# EAGLE design cd32 (EAGLE 7.7.0)
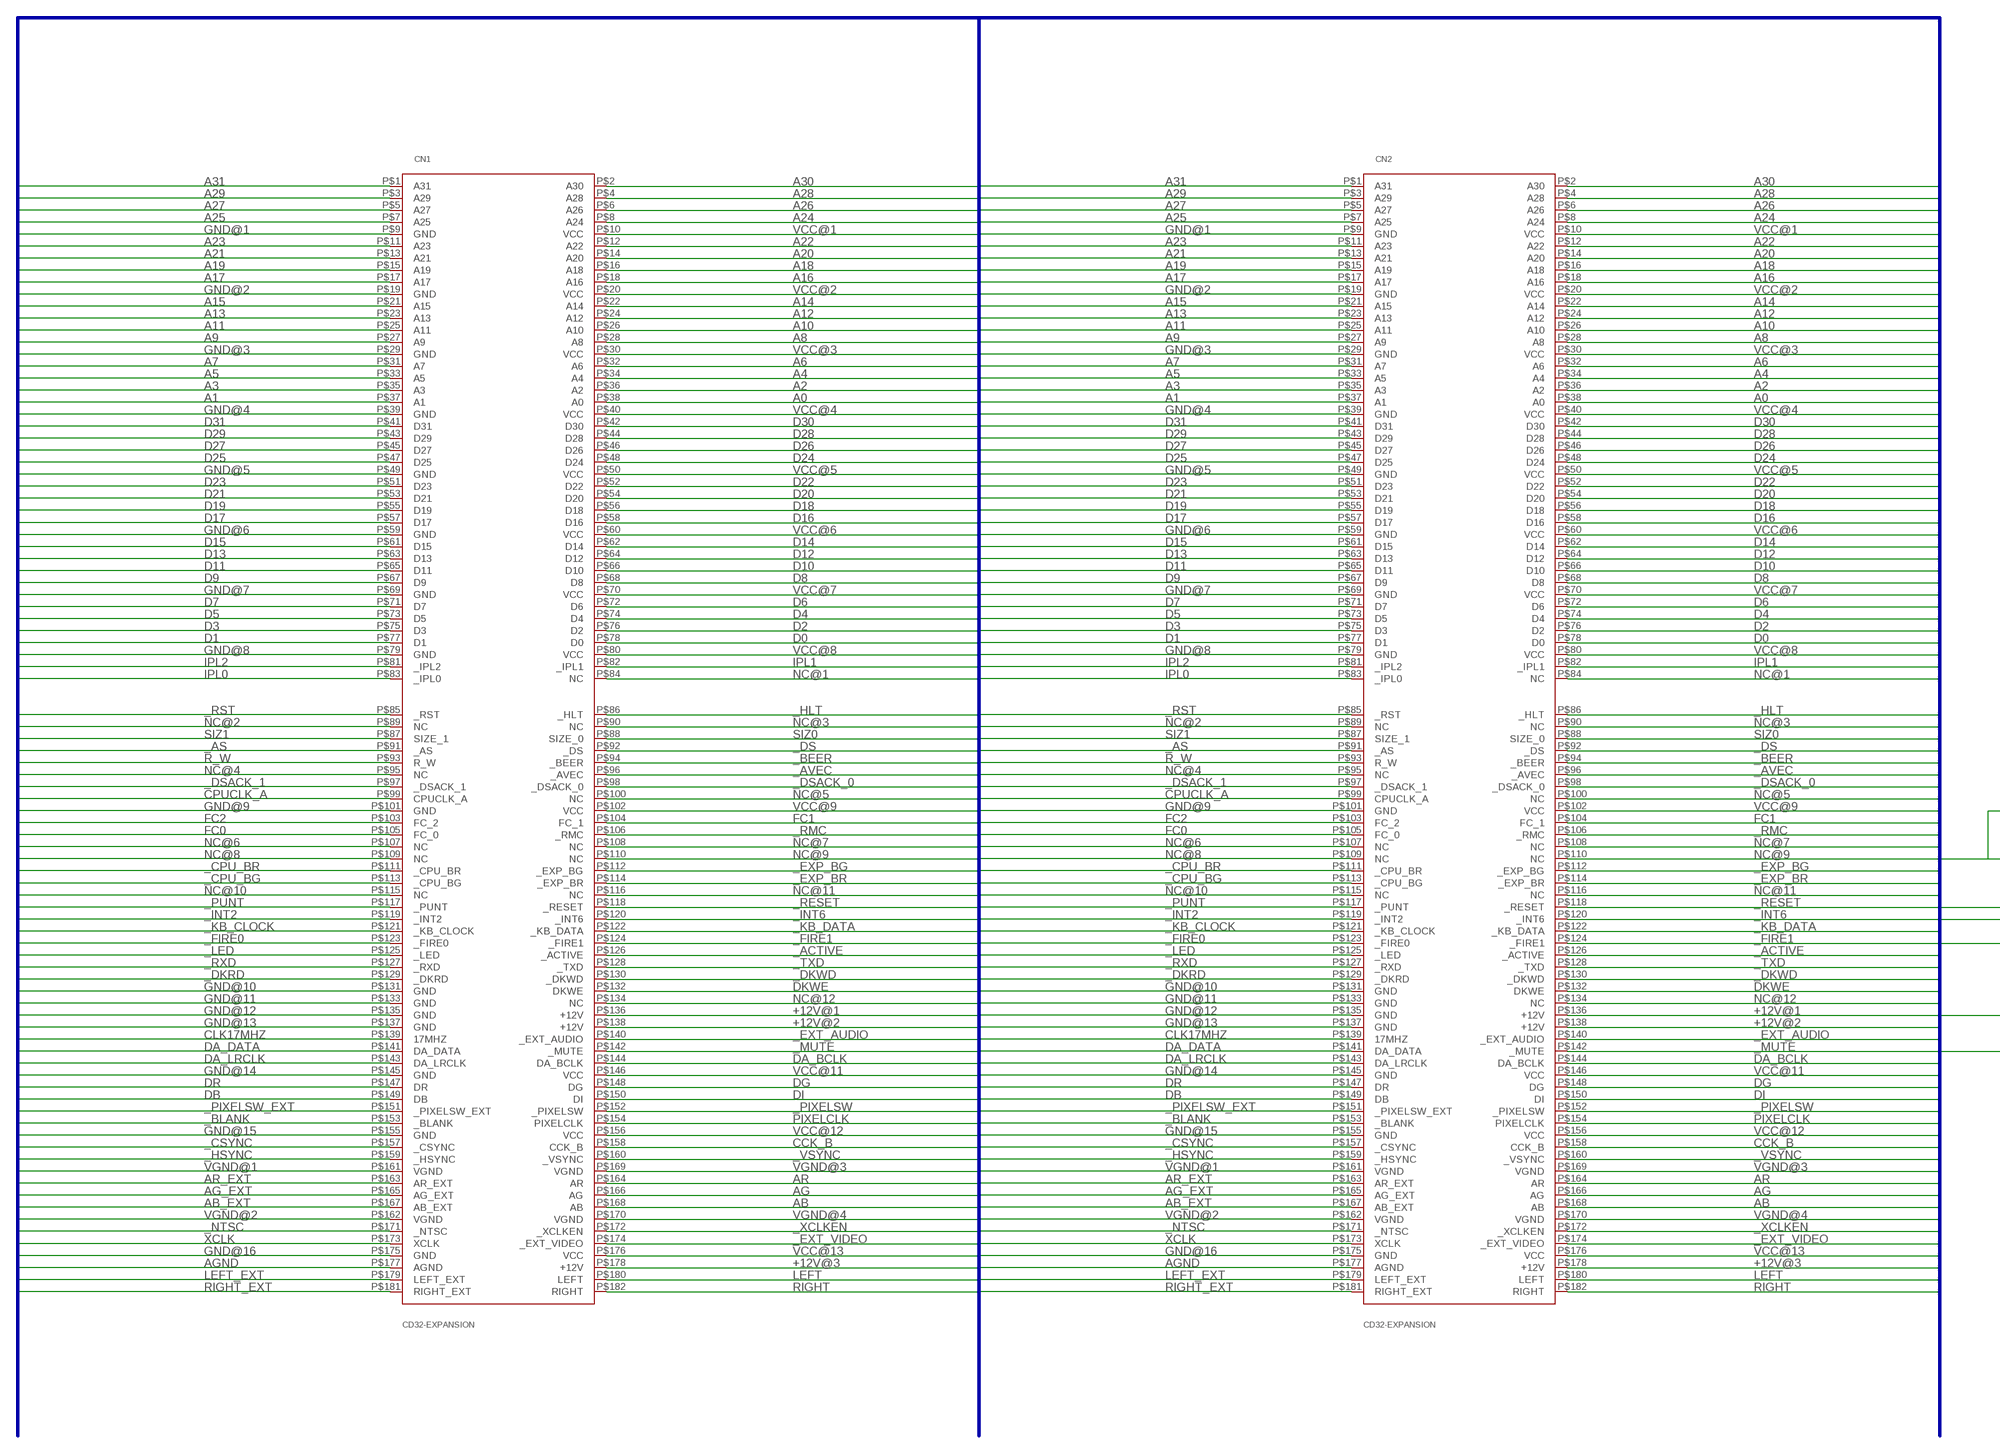
[diagram p0: schematic, sheet 1, part 1 of 2]
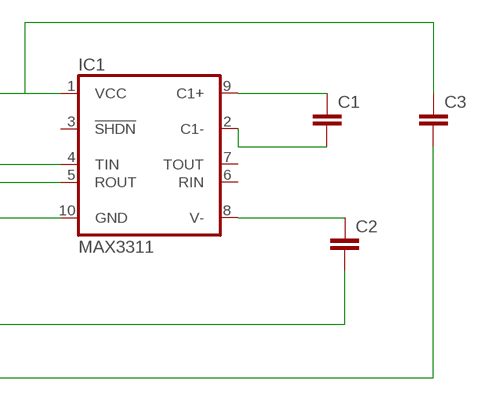
[diagram p1: schematic, sheet 1, part 2 of 2]

## Parts
C1  CC1206  [C1206]
C2  CC1206  [C1206]
C3  CC1206  [C1206]
CN1  CD32-EXPANSION  [CD32_EXPANSION_182_MCA]
CN2  CD32-EXPANSION  [CD32_EXPANSION_182_MCA]
IC1  MAX3311  [UMAX10]

## Nets
+12V@1: C2.2 CN1.P$136(+12V) CN2.P$136(+12V)
+12V@2: CN1.P$138(+12V) CN2.P$138(+12V)
+12V@3: CN1.P$178(+12V) CN2.P$178(+12V)
_ACTIVE: CN1.P$126(_ACTIVE) CN2.P$126(_ACTIVE)
_AS: CN1.P$91(_AS) CN2.P$91(_AS)
_AVEC: CN1.P$96(_AVEC) CN2.P$96(_AVEC)
_BEER: CN1.P$94(_BEER) CN2.P$94(_BEER)
_BLANK: CN1.P$153(_BLANK) CN2.P$153(_BLANK)
_CPU_BG: CN1.P$113(_CPU_BG) CN2.P$113(_CPU_BG)
_CPU_BR: CN1.P$111(_CPU_BR) CN2.P$111(_CPU_BR)
_CSYNC: CN1.P$157(_CSYNC) CN2.P$157(_CSYNC)
_DKRD: CN1.P$129(_DKRD) CN2.P$129(_DKRD)
_DKWD: CN1.P$130(_DKWD) CN2.P$130(_DKWD)
_DS: CN1.P$92(_DS) CN2.P$92(_DS)
_DSACK_0: CN1.P$98(_DSACK_0) CN2.P$98(_DSACK_0)
_DSACK_1: CN1.P$97(_DSACK_1) CN2.P$97(_DSACK_1)
_EXP_BG: CN1.P$112(_EXP_BG) CN2.P$112(_EXP_BG)
_EXP_BR: CN1.P$114(_EXP_BR) CN2.P$114(_EXP_BR)
_EXT_AUDIO: CN1.P$140(_EXT_AUDIO) CN2.P$140(_EXT_AUDIO)
_EXT_VIDEO: CN1.P$174(_EXT_VIDEO) CN2.P$174(_EXT_VIDEO)
_FIRE0: CN1.P$123(_FIRE0) CN2.P$123(_FIRE0)
_FIRE1: CN1.P$124(_FIRE1) CN2.P$124(_FIRE1)
_HLT: CN1.P$86(_HLT) CN2.P$86(_HLT)
_HSYNC: CN1.P$159(_HSYNC) CN2.P$159(_HSYNC)
_INT2: CN1.P$119(_INT2) CN2.P$119(_INT2)
_INT6: CN1.P$120(_INT6) CN2.P$120(_INT6)
_KB_CLOCK: CN1.P$121(_KB_CLOCK) CN2.P$121(_KB_CLOCK)
_KB_DATA: CN1.P$122(_KB_DATA) CN2.P$122(_KB_DATA)
_LED: CN1.P$125(_LED) CN2.P$125(_LED)
_MUTE: CN1.P$142(_MUTE) CN2.P$142(_MUTE)
_NTSC: CN1.P$171(_NTSC) CN2.P$171(_NTSC)
_PIXELSW: CN1.P$152(_PIXELSW) CN2.P$152(_PIXELSW)
_PIXELSW_EXT: CN1.P$151(_PIXELSW_EXT) CN2.P$151(_PIXELSW_EXT)
_PUNT: CN1.P$117(_PUNT) CN2.P$117(_PUNT)
_RESET: CN1.P$118(_RESET) CN2.P$118(_RESET)
_RMC: CN1.P$106(_RMC) CN2.P$106(_RMC)
_RST: CN1.P$85(_RST) CN2.P$85(_RST)
_RXD: CN1.P$127(_RXD) CN2.P$127(_RXD) IC1.5(ROUT)
_TXD: CN1.P$128(_TXD) CN2.P$128(_TXD) IC1.4(TIN)
_VSYNC: CN1.P$160(_VSYNC) CN2.P$160(_VSYNC)
_XCLKEN: CN1.P$172(_XCLKEN) CN2.P$172(_XCLKEN)
A0: CN1.P$38(A0) CN2.P$38(A0)
A1: CN1.P$37(A1) CN2.P$37(A1)
A2: CN1.P$36(A2) CN2.P$36(A2)
A3: CN1.P$35(A3) CN2.P$35(A3)
A4: CN1.P$34(A4) CN2.P$34(A4)
A5: CN1.P$33(A5) CN2.P$33(A5)
A6: CN1.P$32(A6) CN2.P$32(A6)
A7: CN1.P$31(A7) CN2.P$31(A7)
A8: CN1.P$28(A8) CN2.P$28(A8)
A9: CN1.P$27(A9) CN2.P$27(A9)
A10: CN1.P$26(A10) CN2.P$26(A10)
A11: CN1.P$25(A11) CN2.P$25(A11)
A12: CN1.P$24(A12) CN2.P$24(A12)
A13: CN1.P$23(A13) CN2.P$23(A13)
A14: CN1.P$22(A14) CN2.P$22(A14)
A15: CN1.P$21(A15) CN2.P$21(A15)
A16: CN1.P$18(A16) CN2.P$18(A16)
A17: CN1.P$17(A17) CN2.P$17(A17)
A18: CN1.P$16(A18) CN2.P$16(A18)
A19: CN1.P$15(A19) CN2.P$15(A19)
A20: CN1.P$14(A20) CN2.P$14(A20)
A21: CN1.P$13(A21) CN2.P$13(A21)
A22: CN1.P$12(A22) CN2.P$12(A22)
A23: CN1.P$11(A23) CN2.P$11(A23)
A24: CN1.P$8(A24) CN2.P$8(A24)
A25: CN1.P$7(A25) CN2.P$7(A25)
A26: CN1.P$6(A26) CN2.P$6(A26)
A27: CN1.P$5(A27) CN2.P$5(A27)
A28: CN1.P$4(A28) CN2.P$4(A28)
A29: CN1.P$3(A29) CN2.P$3(A29)
A30: CN1.P$2(A30) CN2.P$2(A30)
A31: CN1.P$1(A31) CN2.P$1(A31)
AB: CN1.P$168(AB) CN2.P$168(AB)
AB_EXT: CN1.P$167(AB_EXT) CN2.P$167(AB_EXT)
AG: CN1.P$166(AG) CN2.P$166(AG)
AG_EXT: CN1.P$165(AG_EXT) CN2.P$165(AG_EXT)
AGND: CN1.P$177(AGND) CN2.P$177(AGND)
AR: CN1.P$164(AR) CN2.P$164(AR)
AR_EXT: CN1.P$163(AR_EXT) CN2.P$163(AR_EXT)
CCK_B: CN1.P$158(CCK_B) CN2.P$158(CCK_B)
CLK17MHZ: CN1.P$139(17MHZ) CN2.P$139(17MHZ)
CPUCLK_A: CN1.P$99(CPUCLK_A) CN2.P$99(CPUCLK_A)
D0: CN1.P$78(D0) CN2.P$78(D0)
D1: CN1.P$77(D1) CN2.P$77(D1)
D2: CN1.P$76(D2) CN2.P$76(D2)
D3: CN1.P$75(D3) CN2.P$75(D3)
D4: CN1.P$74(D4) CN2.P$74(D4)
D5: CN1.P$73(D5) CN2.P$73(D5)
D6: CN1.P$72(D6) CN2.P$72(D6)
D7: CN1.P$71(D7) CN2.P$71(D7)
D8: CN1.P$68(D8) CN2.P$68(D8)
D9: CN1.P$67(D9) CN2.P$67(D9)
D10: CN1.P$66(D10) CN2.P$66(D10)
D11: CN1.P$65(D11) CN2.P$65(D11)
D12: CN1.P$64(D12) CN2.P$64(D12)
D13: CN1.P$63(D13) CN2.P$63(D13)
D14: CN1.P$62(D14) CN2.P$62(D14)
D15: CN1.P$61(D15) CN2.P$61(D15)
D16: CN1.P$58(D16) CN2.P$58(D16)
D17: CN1.P$57(D17) CN2.P$57(D17)
D18: CN1.P$56(D18) CN2.P$56(D18)
D19: CN1.P$55(D19) CN2.P$55(D19)
D20: CN1.P$54(D20) CN2.P$54(D20)
D21: CN1.P$53(D21) CN2.P$53(D21)
D22: CN1.P$52(D22) CN2.P$52(D22)
D23: CN1.P$51(D23) CN2.P$51(D23)
D24: CN1.P$48(D24) CN2.P$48(D24)
D25: CN1.P$47(D25) CN2.P$47(D25)
D26: CN1.P$46(D26) CN2.P$46(D26)
D27: CN1.P$45(D27) CN2.P$45(D27)
D28: CN1.P$44(D28) CN2.P$44(D28)
D29: CN1.P$43(D29) CN2.P$43(D29)
D30: CN1.P$42(D30) CN2.P$42(D30)
D31: CN1.P$41(D31) CN2.P$41(D31)
DA_BCLK: CN1.P$144(DA_BCLK) CN2.P$144(DA_BCLK)
DA_DATA: CN1.P$141(DA_DATA) CN2.P$141(DA_DATA)
DA_LRCLK: CN1.P$143(DA_LRCLK) CN2.P$143(DA_LRCLK)
DB: CN1.P$149(DB) CN2.P$149(DB)
DG: CN1.P$148(DG) CN2.P$148(DG)
DI: CN1.P$150(DI) CN2.P$150(DI)
DKWE: CN1.P$132(DKWE) CN2.P$132(DKWE)
DR: CN1.P$147(DR) CN2.P$147(DR)
FC0: CN1.P$105(FC_0) CN2.P$105(FC_0)
FC1: CN1.P$104(FC_1) CN2.P$104(FC_1)
FC2: CN1.P$103(FC_2) CN2.P$103(FC_2)
GND: C3.2 IC1.10(GND)
GND@1: CN1.P$9(GND) CN2.P$9(GND)
GND@2: CN1.P$19(GND) CN2.P$19(GND)
GND@3: CN1.P$29(GND) CN2.P$29(GND)
GND@4: CN1.P$39(GND) CN2.P$39(GND)
GND@5: CN1.P$49(GND) CN2.P$49(GND)
GND@6: CN1.P$59(GND) CN2.P$59(GND)
GND@7: CN1.P$69(GND) CN2.P$69(GND)
GND@8: CN1.P$79(GND) CN2.P$79(GND)
GND@9: CN1.P$101(GND) CN2.P$101(GND)
GND@10: CN1.P$131(GND) CN2.P$131(GND)
GND@11: CN1.P$133(GND) CN2.P$133(GND)
GND@12: CN1.P$135(GND) CN2.P$135(GND)
GND@13: CN1.P$137(GND) CN2.P$137(GND)
GND@14: CN1.P$145(GND) CN2.P$145(GND)
GND@15: CN1.P$155(GND) CN2.P$155(GND)
GND@16: CN1.P$175(GND) CN2.P$175(GND)
IPL0: CN1.P$83(_IPL0) CN2.P$83(_IPL0)
IPL1: CN1.P$82(_IPL1) CN2.P$82(_IPL1)
IPL2: CN1.P$81(_IPL2) CN2.P$81(_IPL2)
LEFT: CN1.P$180(LEFT) CN2.P$180(LEFT)
LEFT_EXT: CN1.P$179(LEFT_EXT) CN2.P$179(LEFT_EXT)
N$1: C1.1 IC1.9(C1+)
N$2: C1.2 IC1.2(C1-)
N$3: C2.1 IC1.8(V-)
NC@1: CN1.P$84(NC) CN2.P$84(NC)
NC@2: CN1.P$89(NC) CN2.P$89(NC)
NC@3: CN1.P$90(NC) CN2.P$90(NC)
NC@4: CN1.P$95(NC) CN2.P$95(NC)
NC@5: CN1.P$100(NC) CN2.P$100(NC)
NC@6: CN1.P$107(NC) CN2.P$107(NC)
NC@7: CN1.P$108(NC) CN2.P$108(NC)
NC@8: CN1.P$109(NC) CN2.P$109(NC)
NC@9: CN1.P$110(NC) CN2.P$110(NC)
NC@10: CN1.P$115(NC) CN2.P$115(NC)
NC@11: CN1.P$116(NC) CN2.P$116(NC)
NC@12: CN1.P$134(NC) CN2.P$134(NC)
PIXELCLK: CN1.P$154(PIXELCLK) CN2.P$154(PIXELCLK)
R_W: CN1.P$93(R_W) CN2.P$93(R_W)
RIGHT: CN1.P$182(RIGHT) CN2.P$182(RIGHT)
RIGHT_EXT: CN1.P$181(RIGHT_EXT) CN2.P$181(RIGHT_EXT)
SIZ0: CN1.P$88(SIZE_0) CN2.P$88(SIZE_0)
SIZ1: CN1.P$87(SIZE_1) CN2.P$87(SIZE_1)
VCC: C3.1 IC1.1(VCC)
VCC@1: CN1.P$10(VCC) CN2.P$10(VCC)
VCC@2: CN1.P$20(VCC) CN2.P$20(VCC)
VCC@3: CN1.P$30(VCC) CN2.P$30(VCC)
VCC@4: CN1.P$40(VCC) CN2.P$40(VCC)
VCC@5: CN1.P$50(VCC) CN2.P$50(VCC)
VCC@6: CN1.P$60(VCC) CN2.P$60(VCC)
VCC@7: CN1.P$70(VCC) CN2.P$70(VCC)
VCC@8: CN1.P$80(VCC) CN2.P$80(VCC)
VCC@9: CN1.P$102(VCC) CN2.P$102(VCC)
VCC@11: CN1.P$146(VCC) CN2.P$146(VCC)
VCC@12: CN1.P$156(VCC) CN2.P$156(VCC)
VCC@13: CN1.P$176(VCC) CN2.P$176(VCC)
VGND@1: CN1.P$161(VGND) CN2.P$161(VGND)
VGND@2: CN1.P$162(VGND) CN2.P$162(VGND)
VGND@3: CN1.P$169(VGND) CN2.P$169(VGND)
VGND@4: CN1.P$170(VGND) CN2.P$170(VGND)
XCLK: CN1.P$173(XCLK) CN2.P$173(XCLK)
Unconnected: IC1.3(!SHDN) IC1.6(RIN) IC1.7(TOUT)

## Buses
A[0..31],AB,AB_EXT,_ACTIVE,AG,AG_EXT,AGND,AR,AR_EXT,_AS,_AVEC,_BEER,_BLANK,CCK_B,CLK_17MHZ,_CPU_BG,_CPU_BR,CPUCLK_A,_CSYNC,D[0..31],DA_BCLK,DA_DATA,DA_LRCLK,DB,DG,DI,_DKRD,_DKWD,DKWE,DR,_DS,_DSACK_0,_DSACK_1,_EXP_BG,_EXP_BR,_EXT_AUDIO,_EXT_VIDEO,FC[0..2],_FIRE0,_FIRE1,GND,_HLT,_HSYNC,_INT2,_INT6,_IPL[0..2],_KB_CLOCK,_KB_DATA,_LED,LEFT,LEFT_EXT,_MUTE,NC,_NTSC,PIXELCLK,_PIXELSW,_PIXELSW_EXT,_PUNT,_RESET,RIGHT,RIGHT_EXT,_RMC,_RST,R_W,_RXD,SIZE[0..1],_TXD,VCC,VCC12V,VGND,_VSYNC,XCLK,_XCLKEN

## Library data of the parts
C1-C3 = eagle-ltspice:C: CAPACITOR, European symbol; SPICEMODEL: NONE; SPICEPREFIX: C
CN1 CN2 = Amiga:CD32-EXPANSION
IC1 = maxim:MAX3311: 460kbps, 1µA Supply Current, RS-232-Compatible Transceivers in µMAX Source: http://www.maxim-ic.com .. MAX3311-MAX3313.pdf; MF: MAXIM; MPN: MAX3311ECUB+; OC_FARNELL: 1379937; OC_NEWARK: 67K4953

## Board
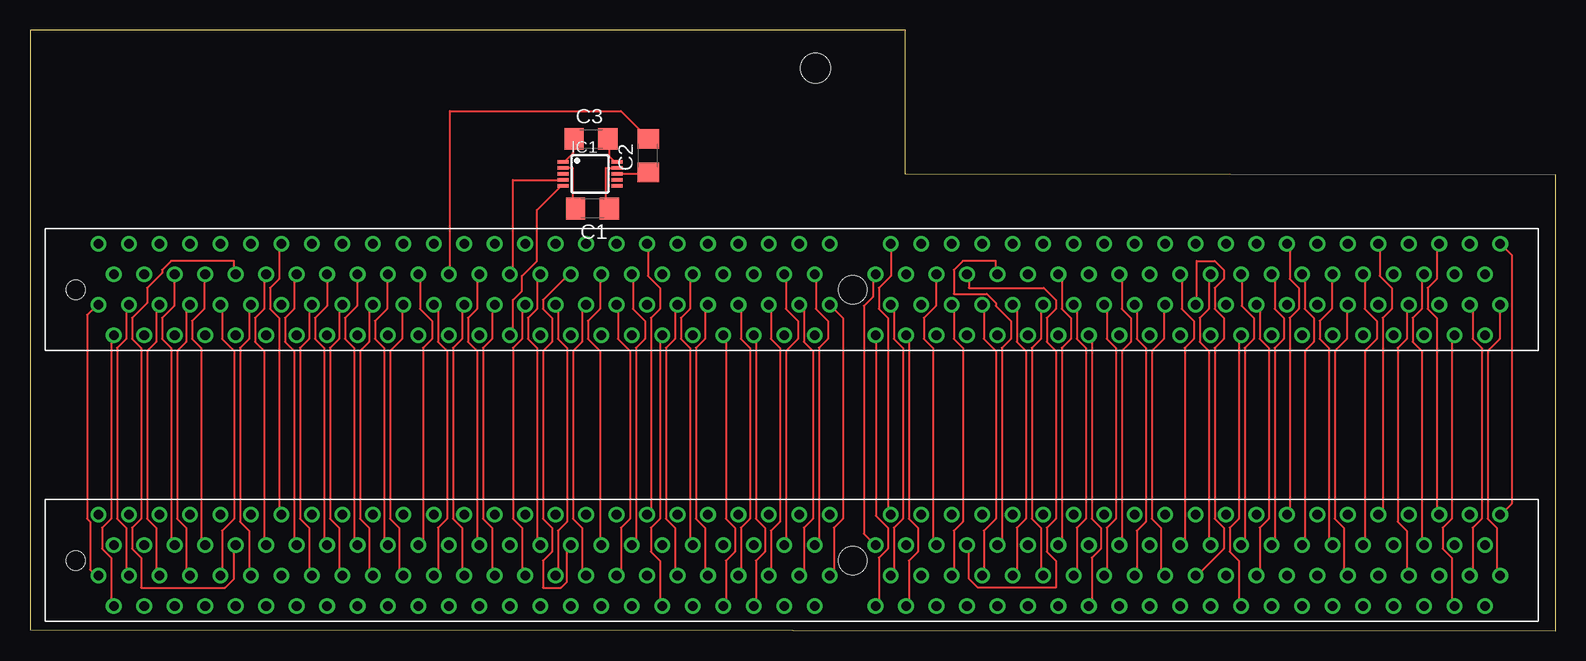
[diagram p2: board, top side]
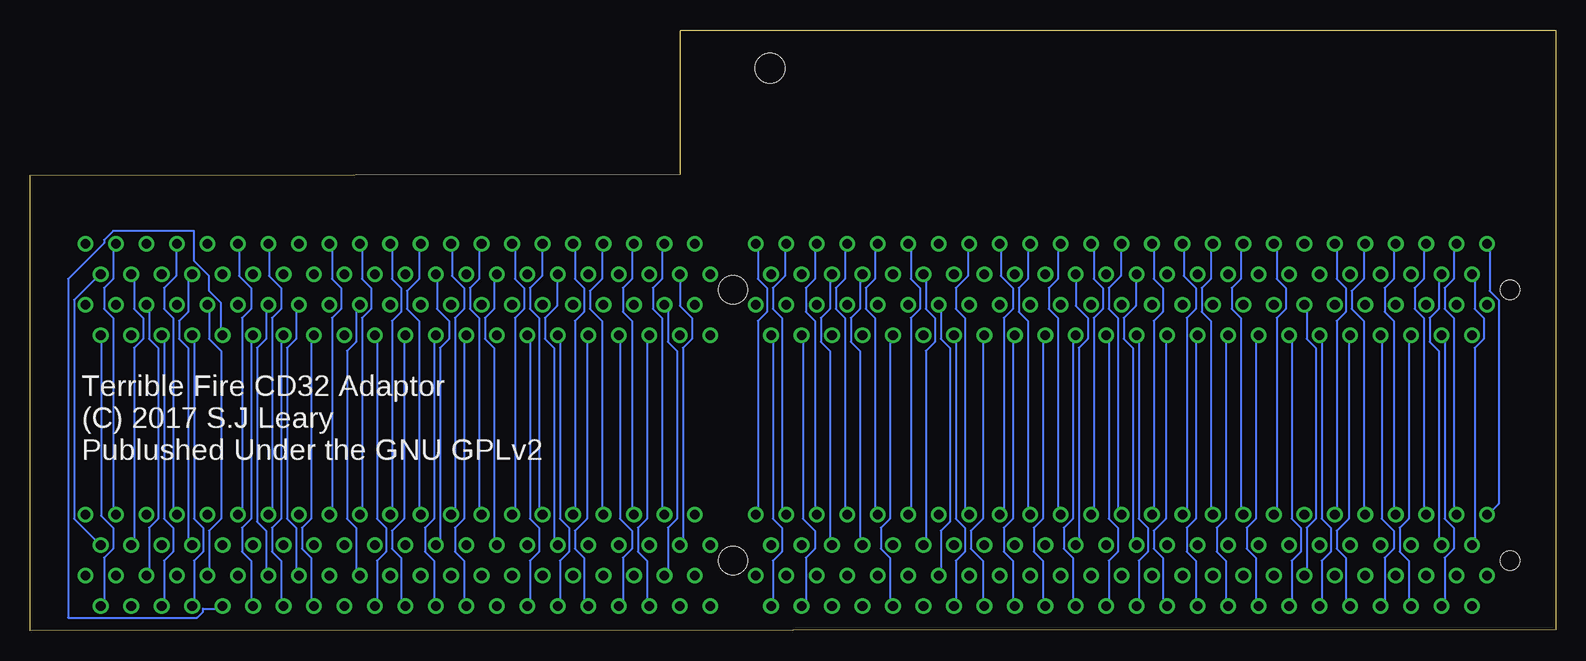
[diagram p3: board, bottom side, seen from below]

Size 127.18 x 50.1 mm. Coordinates in mm from the lower left corner, seen from the top.
Outline: 0,0.1 127.18,0 127.18,38 72.97,38.1 72.97,50.1 0,50.1 0,0.1
Copper layers (1*16): Top 0.035mm / dielectric 1.5mm / Bottom 0.035mm
Design rules "dirt_cheap_dirty_boards.v1 *": minimum track width 7mil, minimum drill 12mil, track to track 6mil, track to pad 6mil, pad to pad 6mil, via to via 6mil, smd to smd 0mil, copper to edge 10mil, drill to drill 10mil, minimum pad ring 10mil, minimum via ring 6mil, stop-mask expansion 2mil, vias tented up to drill 25mil, thermal gap 10mil
Holes 2.5 mm at 65.49,46.92

### Footprints (pad centres in the part's own frame; a part is rotated, then mirrored left to right if it is on the bottom)
C1206 = smd 1.6 x 1.8: 1 -1.4,0; 2 1.4,0
CD32_EXPANSION_182_MCA = drill 0.8: P$1 59.055,-1.27; P$2 59.055,3.81; P$3 57.785,-3.81; P$4 57.785,1.27; P$5 56.515,-1.27; P$6 56.515,3.81; P$7 55.245,-3.81; P$8 55.245,1.27; P$9 53.975,-1.27; P$10 53.975,3.81; P$11 52.705,-3.81; P$12 52.705,1.27; P$13 51.435,-1.27; P$14 51.435,3.81; P$15 50.165,-3.81; P$16 50.165,1.27; P$17 48.895,-1.27; P$18 48.895,3.81; P$19 47.625,-3.81; P$20 47.625,1.27; P$21 46.355,-1.27; P$22 46.355,3.81; P$23 45.085,-3.81; P$24 45.085,1.27; P$25 43.815,-1.27; P$26 43.815,3.81; P$27 42.545,-3.81; P$28 42.545,1.27; P$29 41.275,-1.27; P$30 41.275,3.81; P$31 40.005,-3.81; P$32 40.005,1.27; P$33 38.735,-1.27; P$34 38.735,3.81; P$35 37.465,-3.81; P$36 37.465,1.27; P$37 36.195,-1.27; P$38 36.195,3.81; P$39 34.925,-3.81; P$40 34.925,1.27; P$41 33.655,-1.27; P$42 33.655,3.81; P$43 32.385,-3.81; P$44 32.385,1.27; P$45 31.115,-1.27; P$46 31.115,3.81; P$47 29.845,-3.81; P$48 29.845,1.27; P$49 28.575,-1.27; P$50 28.575,3.81; P$51 27.305,-3.81; P$52 27.305,1.27; P$53 26.035,-1.27; P$54 26.035,3.81; P$55 24.765,-3.81; P$56 24.765,1.27; P$57 23.495,-1.27; P$58 23.495,3.81; P$59 22.225,-3.81; P$60 22.225,1.27; P$61 20.955,-1.27; P$62 20.955,3.81; P$63 19.685,-3.81; P$64 19.685,1.27; P$65 18.415,-1.27; P$66 18.415,3.81; P$67 17.145,-3.81; P$68 17.145,1.27; P$69 15.875,-1.27; P$70 15.875,3.81; P$71 14.605,-3.81; P$72 14.605,1.27; P$73 13.335,-1.27; P$74 13.335,3.81; P$75 12.065,-3.81; P$76 12.065,1.27; P$77 10.795,-1.27; P$78 10.795,3.81; P$79 9.525,-3.81; P$80 9.525,1.27; P$81 8.255,-1.27; P$82 8.255,3.81; P$83 6.985,-3.81; P$84 6.985,1.27; P$85 3.175,-1.27; P$86 3.175,3.81; P$87 1.905,-3.81; P$88 1.905,1.27; P$89 0.635,-1.27; P$90 0.635,3.81; P$91 -0.635,-3.81; P$92 -0.635,1.27; P$93 -1.905,-1.27; P$94 -1.905,3.81; P$95 -3.175,-3.81; P$96 -3.175,1.27; P$97 -4.445,-1.27; P$98 -4.445,3.81; P$99 -5.715,-3.81; P$100 -5.715,1.27; P$101 -6.985,-1.27; P$102 -6.985,3.81; P$103 -8.255,-3.81; P$104 -8.255,1.27; P$105 -9.525,-1.27; P$106 -9.525,3.81; P$107 -10.795,-3.81; P$108 -10.795,1.27; P$109 -12.065,-1.27; P$110 -12.065,3.81; P$111 -13.335,-3.81; P$112 -13.335,1.27; P$113 -14.605,-1.27; P$114 -14.605,3.81; P$115 -15.875,-3.81; P$116 -15.875,1.27; P$117 -17.145,-1.27; P$118 -17.145,3.81; P$119 -18.415,-3.81; P$120 -18.415,1.27; P$121 -19.685,-1.27; P$122 -19.685,3.81; P$123 -20.955,-3.81; P$124 -20.955,1.27; P$125 -22.225,-1.27; P$126 -22.225,3.81; P$127 -23.495,-3.81; P$128 -23.495,1.27; P$129 -24.765,-1.27; P$130 -24.765,3.81; P$131 -26.035,-3.81; P$132 -26.035,1.27; P$133 -27.305,-1.27; P$134 -27.305,3.81; P$135 -28.575,-3.81; P$136 -28.575,1.27; P$137 -29.845,-1.27; P$138 -29.845,3.81; P$139 -31.115,-3.81; P$140 -31.115,1.27; P$141 -32.385,-1.27; P$142 -32.385,3.81; P$143 -33.655,-3.81; P$144 -33.655,1.27; P$145 -34.925,-1.27; P$146 -34.925,3.81; P$147 -36.195,-3.81; P$148 -36.195,1.27; P$149 -37.465,-1.27; P$150 -37.465,3.81; P$151 -38.735,-3.81; P$152 -38.735,1.27; P$153 -40.005,-1.27; P$154 -40.005,3.81; P$155 -41.275,-3.81; P$156 -41.275,1.27; P$157 -42.545,-1.27; P$158 -42.545,3.81; P$159 -43.815,-3.81; P$160 -43.815,1.27; P$161 -45.085,-1.27; P$162 -45.085,3.81; P$163 -46.355,-3.81; P$164 -46.355,1.27; P$165 -47.625,-1.27; P$166 -47.625,3.81; P$167 -48.895,-3.81; P$168 -48.895,1.27; P$169 -50.165,-1.27; P$170 -50.165,3.81; P$171 -51.435,-3.81; P$172 -51.435,1.27; P$173 -52.705,-1.27; P$174 -52.705,3.81; P$175 -53.975,-3.81; P$176 -53.975,1.27; P$177 -55.245,-1.27; P$178 -55.245,3.81; P$179 -56.515,-3.81; P$180 -56.515,1.27; P$181 -57.785,-1.27; P$182 -57.785,3.81 | hole 2.362: 5.08,0 | hole 1.6: -59.69,0
UMAX10 = smd 0.32 x 0.9: 1 -1,-2.25; 2 -0.5,-2.25; 3 0,-2.25; 4 0.5,-2.25; 5 1,-2.25; 6 1,2.25; 7 0.5,2.25; 8 0,2.25; 9 -0.5,2.25; 10 -1,2.25

### Placement (x,y rotation side)
C1  46.89,35.2 180 top
C2  51.54,39.62 90 top
C3  46.76,41.02 0 top
CN1  63.5,5.87 0 top
CN2  63.5,28.45 0 top
IC1  46.69,38.1 270 top

### Tracks (layer width: path | path; a pad name or v marks a point on that pad's centre or on a via)
+12V@1
  Top 0.178: C2.2 51.5,41.1 49.25,43.35 35,43.35 35,29.85 CN2.P$136
  Bottom 0.178: CN1.P$136 35,7.35 35.25,7.6 35.25,23.6 36,24.35 36,26.1 35,27.1 35,29.6 CN2.P$136
+12V@2
  Bottom 0.178: CN1.P$138 33.5,9.85 33.5,25.85 32.75,26.6 32.75,28.6 33.5,29.35 33.5,32.1 CN2.P$138
+12V@3
  Bottom 0.178: CN1.P$178 8.5,9.85 8.5,26.1 9.25,26.85 9.25,28.6 8.5,29.35 8.5,32.1 CN2.P$178
_ACTIVE
  Bottom 0.178: CN1.P$126 41.5,9.85 41.5,26.1 42.25,26.85 42.25,28.6 41.5,29.35 41.5,32.1 CN2.P$126
_AS
  Bottom 0.178: CN1.P$91 62.75,2.1 62.5,2.35 62.5,6.1 61.75,6.85 61.75,8.35 62.75,9.35 62.75,24.6 CN2.P$91
_AVEC
  Bottom 0.178: CN1.P$96 60.5,7.35 60.5,23.35 61.25,24.1 61.25,26.1 60.5,26.85 60.5,29.6 CN2.P$96
_BEER
  Bottom 0.178: CN1.P$94 61.75,9.85 61.75,25.85 62.5,26.6 62.5,28.6 61.75,29.35 61.75,32.1 CN2.P$94
_BLANK
  Top 0.178: CN1.P$153 23.25,4.6 23.25,8.6 22.5,9.35 22.5,23.6 23.25,24.35 23.25,27.1 CN2.P$153
_CPU_BG
  Top 0.178: CN1.P$113 49,4.6 49.25,4.85 49.25,8.6 50,9.35 50,23.35 49,24.35 49,27.1 CN2.P$113
_CPU_BR
  Bottom 0.178: CN1.P$111 50,2.1 50,5.85 49.25,6.6 49.25,8.6 50,9.35 50,24.6 CN2.P$111
_CSYNC
  Bottom 0.178: CN1.P$157 20.75,4.6 20.75,8.6 20,9.35 20,23.6 20.75,24.35 20.75,27.1 CN2.P$157
_DKRD
  Top 0.178: CN1.P$129 38.5,4.6 38.5,8.6 37.75,9.35 37.75,23.6 38.5,24.35 38.5,27.1 CN2.P$129
_DKWD
  Bottom 0.178: CN1.P$130 38.5,9.85 38.5,26.1 37.75,26.85 37.75,28.6 38.5,29.35 38.5,32.1 CN2.P$130
_DS
  Top 0.178: CN1.P$92 63,7.35 63,23.35 64,24.35 64,25.85 63,26.85 63,29.6 CN2.P$92
_DSACK_0
  Bottom 0.178: CN1.P$98 59.25,9.85 59.25,26.1 60,26.85 60,28.6 59.25,29.35 59.25,32.1 CN2.P$98
_DSACK_1
  Top 0.178: CN1.P$97 59.25,4.6 59.25,8.6 60,9.35 60,23.6 59.25,24.35 59.25,27.1 CN2.P$97
_EXP_BG
  Top 0.178: CN1.P$112 50.25,7.35 50.5,7.6 50.5,23.6 51.25,24.35 51.25,25.85 50.25,26.85 50.25,29.6 CN2.P$112
_EXP_BR
  Bottom 0.178: CN1.P$114 49,9.85 49.25,10.1 49.25,26.1 50,26.85 50,28.6 49,29.6 49,32.1 CN2.P$114
_EXT_AUDIO
  Top 0.178: CN1.P$140 32.5,7.35 32.75,7.6 32.75,23.6 33.5,24.35 33.5,25.85 32.5,26.85 32.5,29.6 CN2.P$140
_EXT_VIDEO
  Bottom 0.178: CN1.P$174 11,9.85 11,26.1 11.75,26.85 11.75,28.6 11,29.35 11,32.1 CN2.P$174
_FIRE0
  Bottom 0.178: CN1.P$123 42.75,2.1 42.75,5.85 43.5,6.6 43.5,8.6 42.75,9.35 42.75,24.6 CN2.P$123
_FIRE1
  Top 0.178: CN1.P$124 42.5,7.35 42.25,7.6 42.25,23.6 41.5,24.35 41.5,26.1 42.25,26.85 42.25,29.35 42.5,29.6 CN2.P$124
_HLT
  Bottom 0.178: CN1.P$86 66.5,9.85 66.5,25.85 65.75,26.6 65.75,28.6 66.5,29.35 66.5,32.1 CN2.P$86
_HSYNC
  Bottom 0.178: CN1.P$159 19.5,2.1 19.5,5.85 18.75,6.6 18.75,8.6 19.5,9.35 19.5,24.6 CN2.P$159
_INT2
  Bottom 0.178: CN1.P$119 45.25,2.1 45.25,5.85 46,6.6 46,8.6 45.25,9.35 45.25,24.6 CN2.P$119
_INT6
  Top 0.178: CN1.P$120 45,7.1 44.75,6.85 44.75,4.1 44.25,3.6 42.75,3.6 42.75,5.85 43.5,6.6 43.5,8.6 42.75,9.35 42.75,23.35 43.5,24.1 43.5,26.1 42.75,26.85 42.75,27.6 45,29.85 CN2.P$120
_KB_CLOCK
  Top 0.178: CN1.P$121 44,4.6 44,8.35 44.75,9.1 44.75,23.6 44,24.35 44,27.1 CN2.P$121
_KB_DATA
  Bottom 0.178: CN1.P$122 44,9.85 44,25.85 44.75,26.6 44.75,28.6 44,29.35 44,32.1 CN2.P$122
_LED
  Top 0.178: CN1.P$125 41.25,4.6 41,4.85 41,8.6 40.25,9.35 40.25,23.6 41,24.35 41,26.85 41.25,27.1 CN2.P$125
_MUTE
  Bottom 0.178: CN1.P$142 31,9.85 30.75,10.1 30.75,26.1 30,26.85 30,28.6 31,29.6 31,32.1 CN2.P$142
_NTSC
  Bottom 0.178: CN1.P$171 12.25,2.1 12.25,5.85 13,6.6 13,8.6 12.25,9.35 12.25,24.6 CN2.P$171
_PIXELSW
  Top 0.178: CN1.P$152 24.75,7.35 24.5,7.6 24.5,23.6 23.75,24.35 23.75,26.1 24.75,27.1 24.75,29.6 CN2.P$152
_PIXELSW_EXT
  Bottom 0.178: CN1.P$151 25,2.1 25,6.1 25.75,6.85 25.75,8.6 25,9.35 25,24.6 CN2.P$151
_PUNT
  Top 0.178: CN1.P$117 46.25,4.6 46,4.85 46,8.6 45.25,9.35 45.25,23.35 46,24.1 46,26.85 46.25,27.1 CN2.P$117
_RESET
  Bottom 0.178: CN1.P$118 46.25,9.85 46,10.1 46,26.1 45.25,26.85 45.25,28.6 46.25,29.6 46.25,32.1 CN2.P$118
_RMC
  Bottom 0.178: CN1.P$106 53.75,9.85 53.75,26.1 53,26.85 53,28.6 53.75,29.35 53.75,32.1 CN2.P$106
_RST
  Top 0.178: CN1.P$85 66.75,4.6 67,4.85 67,8.6 67.75,9.35 67.75,26.1 66.75,27.1 CN2.P$85
_RXD
  Top 0.178: IC1.5 44.25,37.1 42.25,35.1 42.25,30.85 41,29.6 41,28.35 40.25,27.6 40.25,24.85 CN2.P$127
  Bottom 0.178: CN1.P$127 40.25,2.1 40.25,6.1 41,6.85 41,8.6 40.25,9.35 40.25,24.6 CN2.P$127
_TXD
  Top 0.178: IC1.4 44.25,37.6 40.25,37.6 40.25,29.85 CN2.P$128
  Bottom 0.178: CN1.P$128 40,7.35 39.75,7.6 39.75,23.6 39,24.35 39,26.1 40,27.1 40,29.6 CN2.P$128
_VSYNC
  Top 0.178: CN1.P$160 19.5,7.35 19.5,23.35 18.75,24.1 18.75,26.1 19.5,26.85 19.5,29.6 CN2.P$160
_XCLKEN
  Top 0.178: CN1.P$172 12,7.35 11.75,7.6 11.75,23.6 11,24.35 11,26.1 12,27.1 12,29.6 CN2.P$172
A0
  Bottom 0.178: CN1.P$38 99.5,9.85 99.5,26.1 98.75,26.85 98.75,28.6 99.5,29.35 99.5,32.1 CN2.P$38
A1
  Bottom 0.178: CN1.P$37 99.75,4.6 100,4.85 100,8.6 100.75,9.35 100.75,23.35 100,24.1 100,26.85 99.75,27.1 CN2.P$37
A2
  Top 0.178: CN1.P$36 101,7.35 101.25,7.6 101.25,23.6 102,24.35 102,26.1 101,27.1 101,29.6 CN2.P$36
A3
  Top 0.178: CN1.P$35 100.75,2.1 100.75,5.85 100,6.6 100,8.6 100.75,9.35 100.75,24.6 CN2.P$35
A4
  Bottom 0.178: CN1.P$34 102,9.85 102,26.1 101.25,26.85 101.25,28.6 102,29.35 102,32.1 CN2.P$34
A5
  Top 0.178: CN1.P$33 102.25,4.6 102.5,4.85 102.5,8.6 103.25,9.35 103.25,23.6 102.5,24.35 102.5,26.85 102.25,27.1 CN2.P$33
A6
  Top 0.178: CN1.P$32 103.75,7.35 103.75,23.6 104.5,24.35 104.5,26.1 103.75,26.85 103.75,29.6 CN2.P$32
A7
  Bottom 0.178: CN1.P$31 103.75,2.1 103.75,6.1 104.5,6.85 104.5,8.6 103.75,9.35 103.75,24.6 CN2.P$31
A8
  Top 0.178: CN1.P$28 106.25,7.35 106.25,23.35 107,24.1 107,26.1 106.25,26.85 106.25,29.6 CN2.P$28
A9
  Bottom 0.178: CN1.P$27 106.25,2.1 106.25,5.85 107,6.6 107,8.6 106.25,9.35 106.25,24.6 CN2.P$27
A10
  Bottom 0.178: CN1.P$26 107.25,9.85 107,10.1 107,26.1 106.25,26.85 106.25,28.6 107.25,29.6 107.25,32.1 CN2.P$26
A11
  Bottom 0.178: CN1.P$25 107.5,4.6 107.5,8.35 108.25,9.1 108.25,23.6 107.5,24.35 107.5,27.1 CN2.P$25
A12
  Top 0.178: CN1.P$24 108.5,7.35 108.25,7.6 108.25,23.6 107.5,24.35 107.5,25.85 108.5,26.85 108.5,29.6 CN2.P$24
A13
  Bottom 0.178: CN1.P$23 108.75,2.1 108.75,5.85 109.5,6.6 109.5,8.6 108.75,9.35 108.75,24.6 CN2.P$23
A14
  Bottom 0.178: CN1.P$22 109.75,9.85 109.5,10.1 109.5,26.1 108.75,26.85 108.75,28.6 109.75,29.6 109.75,32.1 CN2.P$22
A15
  Top 0.178: CN1.P$21 109.75,4.6 109.5,4.85 109.5,8.6 108.75,9.35 108.75,23.35 109.75,24.35 109.75,27.1 CN2.P$21
A16
  Top 0.178: CN1.P$18 112.5,9.85 112.75,10.1 112.75,26.1 113.5,26.85 113.5,28.6 112.5,29.6 112.5,32.1 CN2.P$18
A17
  Bottom 0.178: CN1.P$17 112.25,4.6 112.25,8.35 111.25,9.35 111.25,23.35 112.25,24.35 112.25,27.1 CN2.P$17
A18
  Bottom 0.178: CN1.P$16 113.75,7.35 114,7.6 114,23.6 114.75,24.35 114.75,25.85 114,26.6 114,29.35 113.75,29.6 CN2.P$16
A19
  Bottom 0.178: CN1.P$15 113.5,2.1 113.5,5.85 112.75,6.6 112.75,8.6 113.5,9.35 113.5,24.6 CN2.P$15
A20
  Bottom 0.178: CN1.P$14 115,9.85 115.25,10.1 115.25,26.1 116,26.85 116,28.6 115,29.6 115,32.1 CN2.P$14
A21
  Top 0.178: CN1.P$13 114.75,4.6 114.75,8.35 114,9.1 114,23.6 114.75,24.35 114.75,27.1 CN2.P$13
A22
  Top 0.178: CN1.P$12 116,7.35 116,23.35 115.25,24.1 115.25,26.1 116,26.85 116,29.6 CN2.P$12
A23
  Bottom 0.178: CN1.P$11 116,2.1 116,5.85 115.25,6.6 115.25,8.6 116,9.35 116,24.6 CN2.P$11
A24
  Bottom 0.178: CN1.P$8 118.5,7.35 118.5,23.6 117.75,24.35 117.75,26.1 118.5,26.85 118.5,29.6 CN2.P$8
A25
  Top 0.178: CN1.P$7 118.5,2.1 118.5,6.1 117.75,6.85 117.75,8.6 118.5,9.35 118.5,24.6 CN2.P$7
A26
  Bottom 0.178: CN1.P$6 120.25,9.85 120.25,26.1 121,26.85 121,28.6 120.25,29.35 120.25,32.1 CN2.P$6
A27
  Top 0.178: CN1.P$5 120.25,4.6 120.25,8.6 121,9.35 121,23.6 120.25,24.35 120.25,27.1 CN2.P$5
A28
  Bottom 0.178: CN1.P$4 121.5,7.35 123.5,9.35 123.5,27.6 121.5,29.6 CN2.P$4
A29
  Bottom 0.178: CN1.P$3 121.25,2.1 121,2.35 121,6.1 120.25,6.85 120.25,8.6 121.25,9.6 121.25,24.6 CN2.P$3
A30
  Top 0.178: CN1.P$2 122.75,9.85 123.5,10.6 123.5,31.35 122.75,32.1 CN2.P$2
A31
  Top 0.178: CN1.P$1 122.5,4.6 122.25,4.85 122.25,8.6 121.5,9.35 121.5,23.35 122.5,24.35 122.5,27.1 CN2.P$1
AB
  Top 0.178: CN1.P$168 14.5,7.35 14.25,7.6 14.25,23.6 13.5,24.35 13.5,25.85 14.5,26.85 14.5,29.6 CN2.P$168
AB_EXT
  Bottom 0.178: CN1.P$167 14.5,2.1 14.25,2.35 14.25,6.1 13.5,6.85 13.5,8.35 14.5,9.35 14.5,24.6 CN2.P$167
AG
  Bottom 0.178: CN1.P$166 16,9.85 16,25.85 17,26.85 17,28.35 16,29.35 16,32.1 CN2.P$166
AG_EXT
  Top 0.178: CN1.P$165 16,4.6 16,8.35 17,9.35 17,23.35 16,24.35 16,27.1 CN2.P$165
AGND
  Top 0.178: CN1.P$177 8,4.85 8,8.6 7.25,9.35 7.25,23.6 8,24.35 8,26.85 8.25,27.1 CN2.P$177
AR
  Top 0.178: CN1.P$164 17,7.1 17,4.35 16.25,3.6 9.25,3.6 9.25,6.1 8.5,6.85 8.5,8.6 9.25,9.35 9.25,23.6 8.5,24.35 8.5,26.1 9.75,27.35 9.75,28.6 11,29.85 11,30.1 11.75,30.85 17,30.85 17,29.85 CN2.P$164
AR_EXT
  Bottom 0.178: CN1.P$163 17.25,2.1 17.5,2.35 17.5,6.1 18.25,6.85 18.25,8.35 17.25,9.35 17.25,24.6 CN2.P$163
CCK_B
  Top 0.178: CN1.P$158 20.75,9.85 20.75,26.1 20,26.85 20,28.6 20.75,29.35 20.75,32.1 CN2.P$158
CLK17MHZ
  Bottom 0.178: CN1.P$139 32.5,2.1 32.75,2.35 32.75,6.1 33.5,6.85 33.5,8.35 32.5,9.35 32.5,24.6 CN2.P$139
CPUCLK_A
  Top 0.178: CN1.P$99 58,2.1 58,5.85 58.75,6.6 58.75,8.6 58,9.35 58,24.6 CN2.P$99
D0
  Bottom 0.178: CN1.P$78 74.5,9.85 74.5,26.1 75.25,26.85 75.25,28.6 74.5,29.35 74.5,32.1 CN2.P$78
D1
  Bottom 0.178: CN1.P$77 74.25,4.6 74,4.85 74,8.6 73.25,9.35 73.25,23.35 74,24.1 74,26.85 74.25,27.1 CN2.P$77
D2
  Top 0.178: CN1.P$76 75.5,7.35 75.25,7.6 75.25,23.6 74.5,24.35 74.5,26.1 75.5,27.1 75.5,29.6 CN2.P$76
D3
  Bottom 0.178: CN1.P$75 75.75,2.1 75.75,5.85 76.5,6.6 76.5,8.6 75.75,9.35 75.75,24.6 CN2.P$75
D4
  Bottom 0.178: CN1.P$74 77,9.85 77,25.85 77.75,26.6 77.75,28.6 77,29.35 77,32.1 CN2.P$74
D5
  Top 0.178: CN1.P$73 77,4.6 77,8.35 77.75,9.1 77.75,23.6 77,24.35 77,27.1 CN2.P$73
D6
  Top 0.178: CN1.P$72 78.25,7.1 78.25,4.35 79,3.6 85.5,3.6 85.5,5.85 84.75,6.6 84.75,8.6 85.5,9.35 85.5,23.35 84.75,24.1 84.75,26.1 85.5,26.85 85.5,27.6 84.5,28.6 78.25,28.6 78.25,29.6 CN2.P$72
D7
  Bottom 0.178: CN1.P$71 78,2.1 77.75,2.35 77.75,6.1 77,6.85 77,8.35 78,9.35 78,24.6 CN2.P$71
D8
  Top 0.178: CN1.P$68 80.75,7.35 81,7.6 81,23.6 81.75,24.35 81.75,25.85 80.5,27.1 80.5,27.35 79.75,28.1 77,28.1 77,30.1 77.75,30.85 80.5,30.85 80.5,29.85 CN2.P$68
D9
  Bottom 0.178: CN1.P$67 80.75,2.1 81,2.35 81,6.1 81.75,6.85 81.75,8.35 80.75,9.35 80.75,24.6 CN2.P$67
D10
  Bottom 0.178: CN1.P$66 81.75,9.85 81.75,25.85 81,26.6 81,28.6 81.75,29.35 81.75,32.1 CN2.P$66
D11
  Top 0.178: CN1.P$65 82,4.6 82.25,4.85 82.25,8.6 83,9.35 83,23.35 82.25,24.1 82.25,26.85 82,27.1 CN2.P$65
D12
  Bottom 0.178: CN1.P$64 83.25,7.35 83.5,7.6 83.5,23.6 84.25,24.35 84.25,26.1 83.25,27.1 83.25,29.6 CN2.P$64
D13
  Bottom 0.178: CN1.P$63 83,2.1 83,5.85 82.25,6.6 82.25,8.6 83,9.35 83,24.6 CN2.P$63
D14
  Bottom 0.178: CN1.P$62 84.5,9.85 84.75,10.1 84.75,26.1 85.5,26.85 85.5,28.6 84.5,29.6 84.5,32.1 CN2.P$62
D15
  Top 0.178: CN1.P$61 84.25,4.6 84.25,8.6 83.5,9.35 83.5,23.6 84.25,24.35 84.25,27.1 CN2.P$61
D16
  Bottom 0.178: CN1.P$58 86.75,9.85 86.75,26.1 86,26.85 86,28.6 86.75,29.35 86.75,32.1 CN2.P$58
D17
  Top 0.178: CN1.P$57 87.25,4.85 87.25,8.6 88,9.35 88,23.6 87.25,24.35 87.25,26.85 87,27.1 CN2.P$57
D18
  Bottom 0.178: CN1.P$56 88.5,7.35 88.5,23.6 89.25,24.35 89.25,26.1 88.5,26.85 88.5,29.6 CN2.P$56
D19
  Top 0.178: CN1.P$55 88.5,2.1 88.5,6.1 89.25,6.85 89.25,8.6 88.5,9.35 88.5,24.6 CN2.P$55
D20
  Bottom 0.178: CN1.P$54 89.75,9.85 89.75,26.1 90.5,26.85 90.5,28.6 89.75,29.35 89.75,32.1 CN2.P$54
D21
  Top 0.178: CN1.P$53 89.75,4.6 89.75,8.6 90.5,9.35 90.5,23.6 89.75,24.35 89.75,27.1 CN2.P$53
D22
  Top 0.178: CN1.P$52 91,7.35 91,23.35 91.75,24.1 91.75,26.1 91,26.85 91,29.6 CN2.P$52
D23
  Bottom 0.178: CN1.P$51 91,2.1 91,5.85 91.75,6.6 91.75,8.6 91,9.35 91,24.6 CN2.P$51
D24
  Bottom 0.178: CN1.P$48 93.25,7.35 93,7.6 93,23.6 92.25,24.35 92.25,25.85 93.25,26.85 93.25,29.6 CN2.P$48
D25
  Bottom 0.178: CN1.P$47 93.5,2.1 93.5,5.85 94.25,6.6 94.25,8.6 93.5,9.35 93.5,24.6 CN2.P$47
D26
  Bottom 0.178: CN1.P$46 94.75,9.85 94.75,25.85 95.75,26.85 95.75,28.35 94.75,29.35 94.75,32.1 CN2.P$46
D27
  Top 0.178: CN1.P$45 94.5,4.6 94.25,4.85 94.25,8.6 93.5,9.35 93.5,23.35 94.5,24.35 94.5,27.1 CN2.P$45
D28
  Top 0.178: CN1.P$44 96,7.35 96.25,7.6 96.25,23.6 97,24.35 97,25.85 96,26.85 96,29.6 CN2.P$44
D29
  Bottom 0.178: CN1.P$43 96,2.1 96.25,2.35 96.25,6.1 97,6.85 97,8.35 96,9.35 96,24.6 CN2.P$43
D30
  Bottom 0.178: CN1.P$42 97,9.85 97,25.85 96.25,26.6 96.25,28.6 97,29.35 97,32.1 CN2.P$42
D31
  Top 0.178: CN1.P$41 97.25,4.6 99.5,6.85 99.5,8.6 98.75,9.35 98.75,23.6 99.5,24.35 99.5,26.1 98.75,26.85 98.75,28.6 99.5,29.35 99.5,30.1 98.75,30.85 97.25,30.85 97.25,27.35 CN2.P$41
DA_BCLK
  Top 0.178: CN1.P$144 29.75,7.35 29.5,7.6 29.5,23.6 28.75,24.35 28.75,25.85 29.75,26.85 29.75,29.6 CN2.P$144
DA_DATA
  Top 0.178: CN1.P$141 31,4.6 30.75,4.85 30.75,8.6 30,9.35 30,23.35 31,24.35 31,27.1 CN2.P$141
DA_LRCLK
  Bottom 0.178: CN1.P$143 30,2.1 30,5.85 30.75,6.6 30.75,8.6 30,9.35 30,24.6 CN2.P$143
DB
  Top 0.178: CN1.P$149 26,4.6 25.75,4.85 25.75,8.6 25,9.35 25,23.6 25.75,24.35 25.75,26.85 26,27.1 CN2.P$149
DG
  Top 0.178: CN1.P$148 27.25,7.35 27,7.6 27,23.6 26.25,24.35 26.25,26.1 27.25,27.1 27.25,29.6 CN2.P$148
DI
  Bottom 0.178: CN1.P$150 26.25,9.85 26.25,26.1 27,26.85 27,28.6 26.25,29.35 26.25,32.1 CN2.P$150
DKWE
  Top 0.178: CN1.P$132 37.25,7.35 37.25,23.35 36.5,24.1 36.5,26.1 37.25,26.85 37.25,29.6 CN2.P$132
DR
  Bottom 0.178: CN1.P$147 27.5,2.1 27.5,5.85 28.25,6.6 28.25,8.6 27.5,9.35 27.5,24.6 CN2.P$147
FC0
  Top 0.178: CN1.P$105 53.75,4.6 53.75,8.6 53,9.35 53,23.6 53.75,24.35 53.75,27.1 CN2.P$105
FC1
  Top 0.178: CN1.P$104 55,7.35 55,23.6 54.25,24.35 54.25,26.1 55,26.85 55,29.6 CN2.P$104
FC2
  Bottom 0.178: CN1.P$103 55.25,2.1 55.5,2.35 55.5,6.1 56.25,6.85 56.25,8.6 55.5,9.35 55.5,24.35 55.25,24.6 CN2.P$103
GND
  Top 0.178: IC1.10 48.75,39.1 48.25,39.6 48.25,40.85 C3.2
GND@1
  Bottom 0.178: CN1.P$9 117.25,4.6 117.25,8.6 116.5,9.35 116.5,23.6 117.25,24.35 117.25,27.1 CN2.P$9
GND@2
  Bottom 0.178: CN1.P$19 111.25,1.85 112.75,1.85 112.75,1.6 113.25,1.1 124,1.1 124,29.35 121,32.35 121,32.6 120.25,33.35 113.5,33.35 113.5,30.85 112.25,29.6 112.25,28.35 111.25,27.35 111.25,24.85 CN2.P$19
GND@3
  Bottom 0.178: CN1.P$29 105,4.6 105,8.6 105.75,9.35 105.75,23.6 105,24.35 105,27.1 CN2.P$29
GND@4
  Bottom 0.178: CN1.P$39 98.25,2.1 98.25,5.85 97.5,6.6 97.5,8.6 98.25,9.35 98.25,24.6 CN2.P$39
GND@5
  Top 0.178: CN1.P$49 92.25,4.6 92.25,8.35 93,9.1 93,23.6 92.25,24.35 92.25,27.1 CN2.P$49
GND@6
  Bottom 0.178: CN1.P$59 85.5,2.1 85.5,5.85 84.75,6.6 84.75,8.6 85.5,9.35 85.5,24.6 CN2.P$59
GND@7
  Top 0.178: CN1.P$69 79.5,4.6 79.5,8.35 80.5,9.35 80.5,23.35 79.5,24.35 79.5,27.1 CN2.P$69
GND@8
  Top 0.178: CN1.P$79 73.25,2.1 73.25,5.85 74,6.6 74,8.6 73.25,9.35 73.25,24.6 CN2.P$79
GND@9
  Top 0.178: CN1.P$101 56.5,4.6 56.25,4.85 56.25,8.6 55.5,9.35 55.5,23.6 56.25,24.35 56.25,26.85 56.5,27.1 CN2.P$101
GND@10
  Bottom 0.178: CN1.P$131 37.25,2.1 37.25,5.85 36.5,6.6 36.5,8.6 37.25,9.35 37.25,24.6 CN2.P$131
GND@11
  Top 0.178: CN1.P$133 36,4.6 36,8.6 35.25,9.35 35.25,23.6 36,24.35 36,27.1 CN2.P$133
GND@12
  Bottom 0.178: CN1.P$135 34.75,2.1 34.75,5.85 34,6.6 34,8.6 34.75,9.35 34.75,24.6 CN2.P$135
GND@13
  Top 0.178: CN1.P$137 33.75,4.6 34,4.85 34,8.6 34.75,9.35 34.75,23.35 34,24.1 34,26.85 33.75,27.1 CN2.P$137
GND@14
  Top 0.178: CN1.P$145 28.5,4.6 28.25,4.85 28.25,8.6 27.5,9.35 27.5,23.35 28.25,24.1 28.25,26.85 28.5,27.1 CN2.P$145
GND@15
  Bottom 0.178: CN1.P$155 22,2.1 22,5.85 21.25,6.6 21.25,8.6 22,9.35 22,24.6 CN2.P$155
GND@16
  Bottom 0.178: CN1.P$175 9.5,2.1 9.25,2.35 9.25,6.1 8.5,6.85 8.5,8.6 9.25,9.35 9.25,24.35 9.5,24.6 CN2.P$175
IPL0
  Top 0.178: CN1.P$83 70.5,2.1 70.75,2.35 70.75,6.1 71.5,6.85 71.5,8.6 70.5,9.6 70.5,24.6 CN2.P$83
IPL1
  Top 0.178: CN1.P$82 71.75,9.85 71.5,10.1 71.5,26.1 70.75,26.85 70.75,28.6 71.75,29.6 71.75,32.1 CN2.P$82
IPL2
  Top 0.178: CN1.P$81 72,4.6 72,8.6 72.75,9.35 72.75,23.6 72,24.35 72,27.1 CN2.P$81
LEFT
  Bottom 0.178: CN1.P$180 6.75,7.35 6.75,23.6 6,24.35 6,26.1 6.75,26.85 6.75,29.6 CN2.P$180
LEFT_EXT
  Top 0.178: CN1.P$179 6.75,2.1 6.75,6.1 6,6.85 6,8.6 6.75,9.35 6.75,24.6 CN2.P$179
N$1
  Top 0.178: IC1.9 48.75,38.6 48,38.6 48,35.6 48.25,35.35 C1.1
N$2
  Top 0.178: IC1.2 44.5,38.6 45.25,38.6 45.25,35.35 C1.2
N$3
  Top 0.178: IC1.8 49,38.1 51.5,38.1 C2.1
NC@1
  Top 0.178: CN1.P$84 70.25,7.35 69.5,8.1 69.5,27.1 70.25,27.85 70.25,29.6 CN2.P$84
NC@2
  Top 0.178: CN1.P$89 64.25,4.6 64.5,4.85 64.5,8.6 65.25,9.35 65.25,23.35 64.5,24.1 64.5,26.85 64.25,27.1 CN2.P$89
NC@3
  Bottom 0.178: CN1.P$90 64.25,9.85 64.5,10.1 64.5,26.1 65.25,26.85 65.25,28.6 64.25,29.6 64.25,32.1 CN2.P$90
NC@4
  Top 0.178: CN1.P$95 60.5,2.1 60.5,5.85 61.25,6.6 61.25,8.6 60.5,9.35 60.5,24.6 CN2.P$95
NC@5
  Bottom 0.178: CN1.P$100 58,7.35 58,23.35 58.75,24.1 58.75,26.1 58,26.85 58,29.6 CN2.P$100
NC@6
  Top 0.178: CN1.P$107 52.5,2.1 52.5,5.85 51.75,6.6 51.75,8.6 52.5,9.35 52.5,24.6 CN2.P$107
NC@7
  Bottom 0.178: CN1.P$108 52.5,7.35 52.5,23.35 51.75,24.1 51.75,26.1 52.5,26.85 52.5,29.6 CN2.P$108
NC@8
  Bottom 0.178: CN1.P$109 51.25,4.6 51.25,8.35 50.5,9.1 50.5,23.6 51.25,24.35 51.25,27.1 CN2.P$109
NC@9
  Top 0.178: CN1.P$110 51.5,9.85 51.75,10.1 51.75,26.1 52.5,26.85 52.5,28.6 51.5,29.6 51.5,32.1 CN2.P$110
NC@10
  Bottom 0.178: CN1.P$115 47.75,2.1 47.75,5.85 48.75,6.85 48.75,8.35 47.75,9.35 47.75,24.6 CN2.P$115
NC@11
  Top 0.178: CN1.P$116 47.5,7.35 47.5,23.35 46.5,24.35 46.5,25.85 47.5,26.85 47.5,29.6 CN2.P$116
NC@12
  Bottom 0.178: CN1.P$134 36.25,9.85 36.5,10.1 36.5,26.1 37.25,26.85 37.25,28.6 36.25,29.6 36.25,32.1 CN2.P$134
PIXELCLK
  Bottom 0.178: CN1.P$154 23.25,9.85 23.25,26.1 22.5,26.85 22.5,28.6 23.25,29.35 23.25,32.1 CN2.P$154
R_W
  Top 0.178: CN1.P$93 61.75,4.6 61.75,8.35 62.5,9.1 62.5,23.6 61.75,24.35 61.75,27.1 CN2.P$93
RIGHT
  Bottom 0.178: CN1.P$182 5.5,9.85 4.75,10.6 4.75,27.6 5.5,28.35 5.5,32.1 CN2.P$182
RIGHT_EXT
  Top 0.178: CN1.P$181 5.5,4.6 5,5.1 5,9.1 4.75,9.35 4.75,26.35 5.5,27.1 CN2.P$181
SIZ0
  Top 0.178: CN1.P$88 65.5,7.35 65.75,7.6 65.75,23.6 66.5,24.35 66.5,25.85 65.5,26.85 65.5,29.6 CN2.P$88
SIZ1
  Bottom 0.178: CN1.P$87 65.25,2.1 65.25,5.85 64.5,6.6 64.5,8.6 65.25,9.35 65.25,24.6 CN2.P$87
VCC
  Top 0.178: IC1.1 44.5,39.1 45.25,39.85 45.25,40.85 C3.1
VCC@1
  Top 0.178: CN1.P$10 117.25,9.85 117.25,26.1 116.5,26.85 116.5,28.6 117.25,29.35 117.25,32.1 CN2.P$10
VCC@2
  Top 0.178: CN1.P$20 111.25,7.35 111.25,23.35 112.25,24.35 112.25,25.85 111.25,26.85 111.25,29.6 CN2.P$20
VCC@3
  Top 0.178: CN1.P$30 105,9.85 105,26.1 105.75,26.85 105.75,28.6 105,29.35 105,32.1 CN2.P$30
VCC@4
  Top 0.178: CN1.P$40 98.25,7.35 98.25,23.35 97.5,24.1 97.5,26.1 98.25,26.85 98.25,29.6 CN2.P$40
VCC@5
  Bottom 0.178: CN1.P$50 92,9.85 91.75,10.1 91.75,26.1 91,26.85 91,28.6 92,29.6 92,32.1 CN2.P$50
VCC@6
  Top 0.178: CN1.P$60 85.75,7.35 86,7.6 86,23.6 86.75,24.35 86.75,26.1 86,26.85 86,29.35 85.75,29.6 CN2.P$60
VCC@7
  Bottom 0.178: CN1.P$70 79.5,9.85 79.5,25.85 80.5,26.85 80.5,28.35 79.5,29.35 79.5,32.1 CN2.P$70
VCC@8
  Bottom 0.178: CN1.P$80 73,7.35 72.75,7.6 72.75,23.6 72,24.35 72,26.1 73,27.1 73,29.6 CN2.P$80
VCC@9
  Bottom 0.178: CN1.P$102 56.75,9.85 56.75,26.1 57.5,26.85 57.5,28.6 56.75,29.35 56.75,32.1 CN2.P$102
VCC@11
  Bottom 0.178: CN1.P$146 28.75,9.85 28.75,25.85 29.5,26.6 29.5,28.6 28.75,29.35 28.75,32.1 CN2.P$146
VCC@12
  Top 0.178: CN1.P$156 22,7.35 22,23.35 21.25,24.1 21.25,26.1 22,26.85 22,29.6 CN2.P$156
VCC@13
  Bottom 0.178: CN1.P$176 9.75,7.35 9.75,23.35 10.5,24.1 10.5,26.1 9.75,26.85 9.75,29.6 CN2.P$176
VGND@1
  Top 0.178: CN1.P$161 18.25,4.6 18.25,8.35 17.5,9.1 17.5,23.6 18.25,24.35 18.25,27.1 CN2.P$161
VGND@2
  Bottom 0.178: CN1.P$162 18.25,9.85 18.25,25.85 17.5,26.6 17.5,28.6 18.25,29.35 18.25,32.1 CN2.P$162
VGND@3
  Top 0.178: CN1.P$169 13.25,4.6 13,4.85 13,8.6 12.25,9.35 12.25,23.35 13,24.1 13,26.85 13.25,27.1 CN2.P$169
VGND@4
  Bottom 0.178: CN1.P$170 13.5,9.85 13.5,25.85 14.25,26.6 14.25,28.6 13.5,29.35 13.5,32.1 CN2.P$170
XCLK
  Top 0.178: CN1.P$173 10.75,4.6 10.5,4.85 10.5,8.6 9.75,9.35 9.75,23.35 10.5,24.1 10.5,26.85 10.75,27.1 CN2.P$173

### Text on the board
bNames: Terrible Fire CD32 Adaptor / (C) 2017 S.J Leary / Publushed Under the GNU GPLv2